# EasyEDA schematic 1-Schematic_power_supply.json
TITLE: Sheet_1; REV: 1.0; Date: 2023-05-28; Sheet: 1/1; Drawn By: rf3mechanic; Company: Your Company
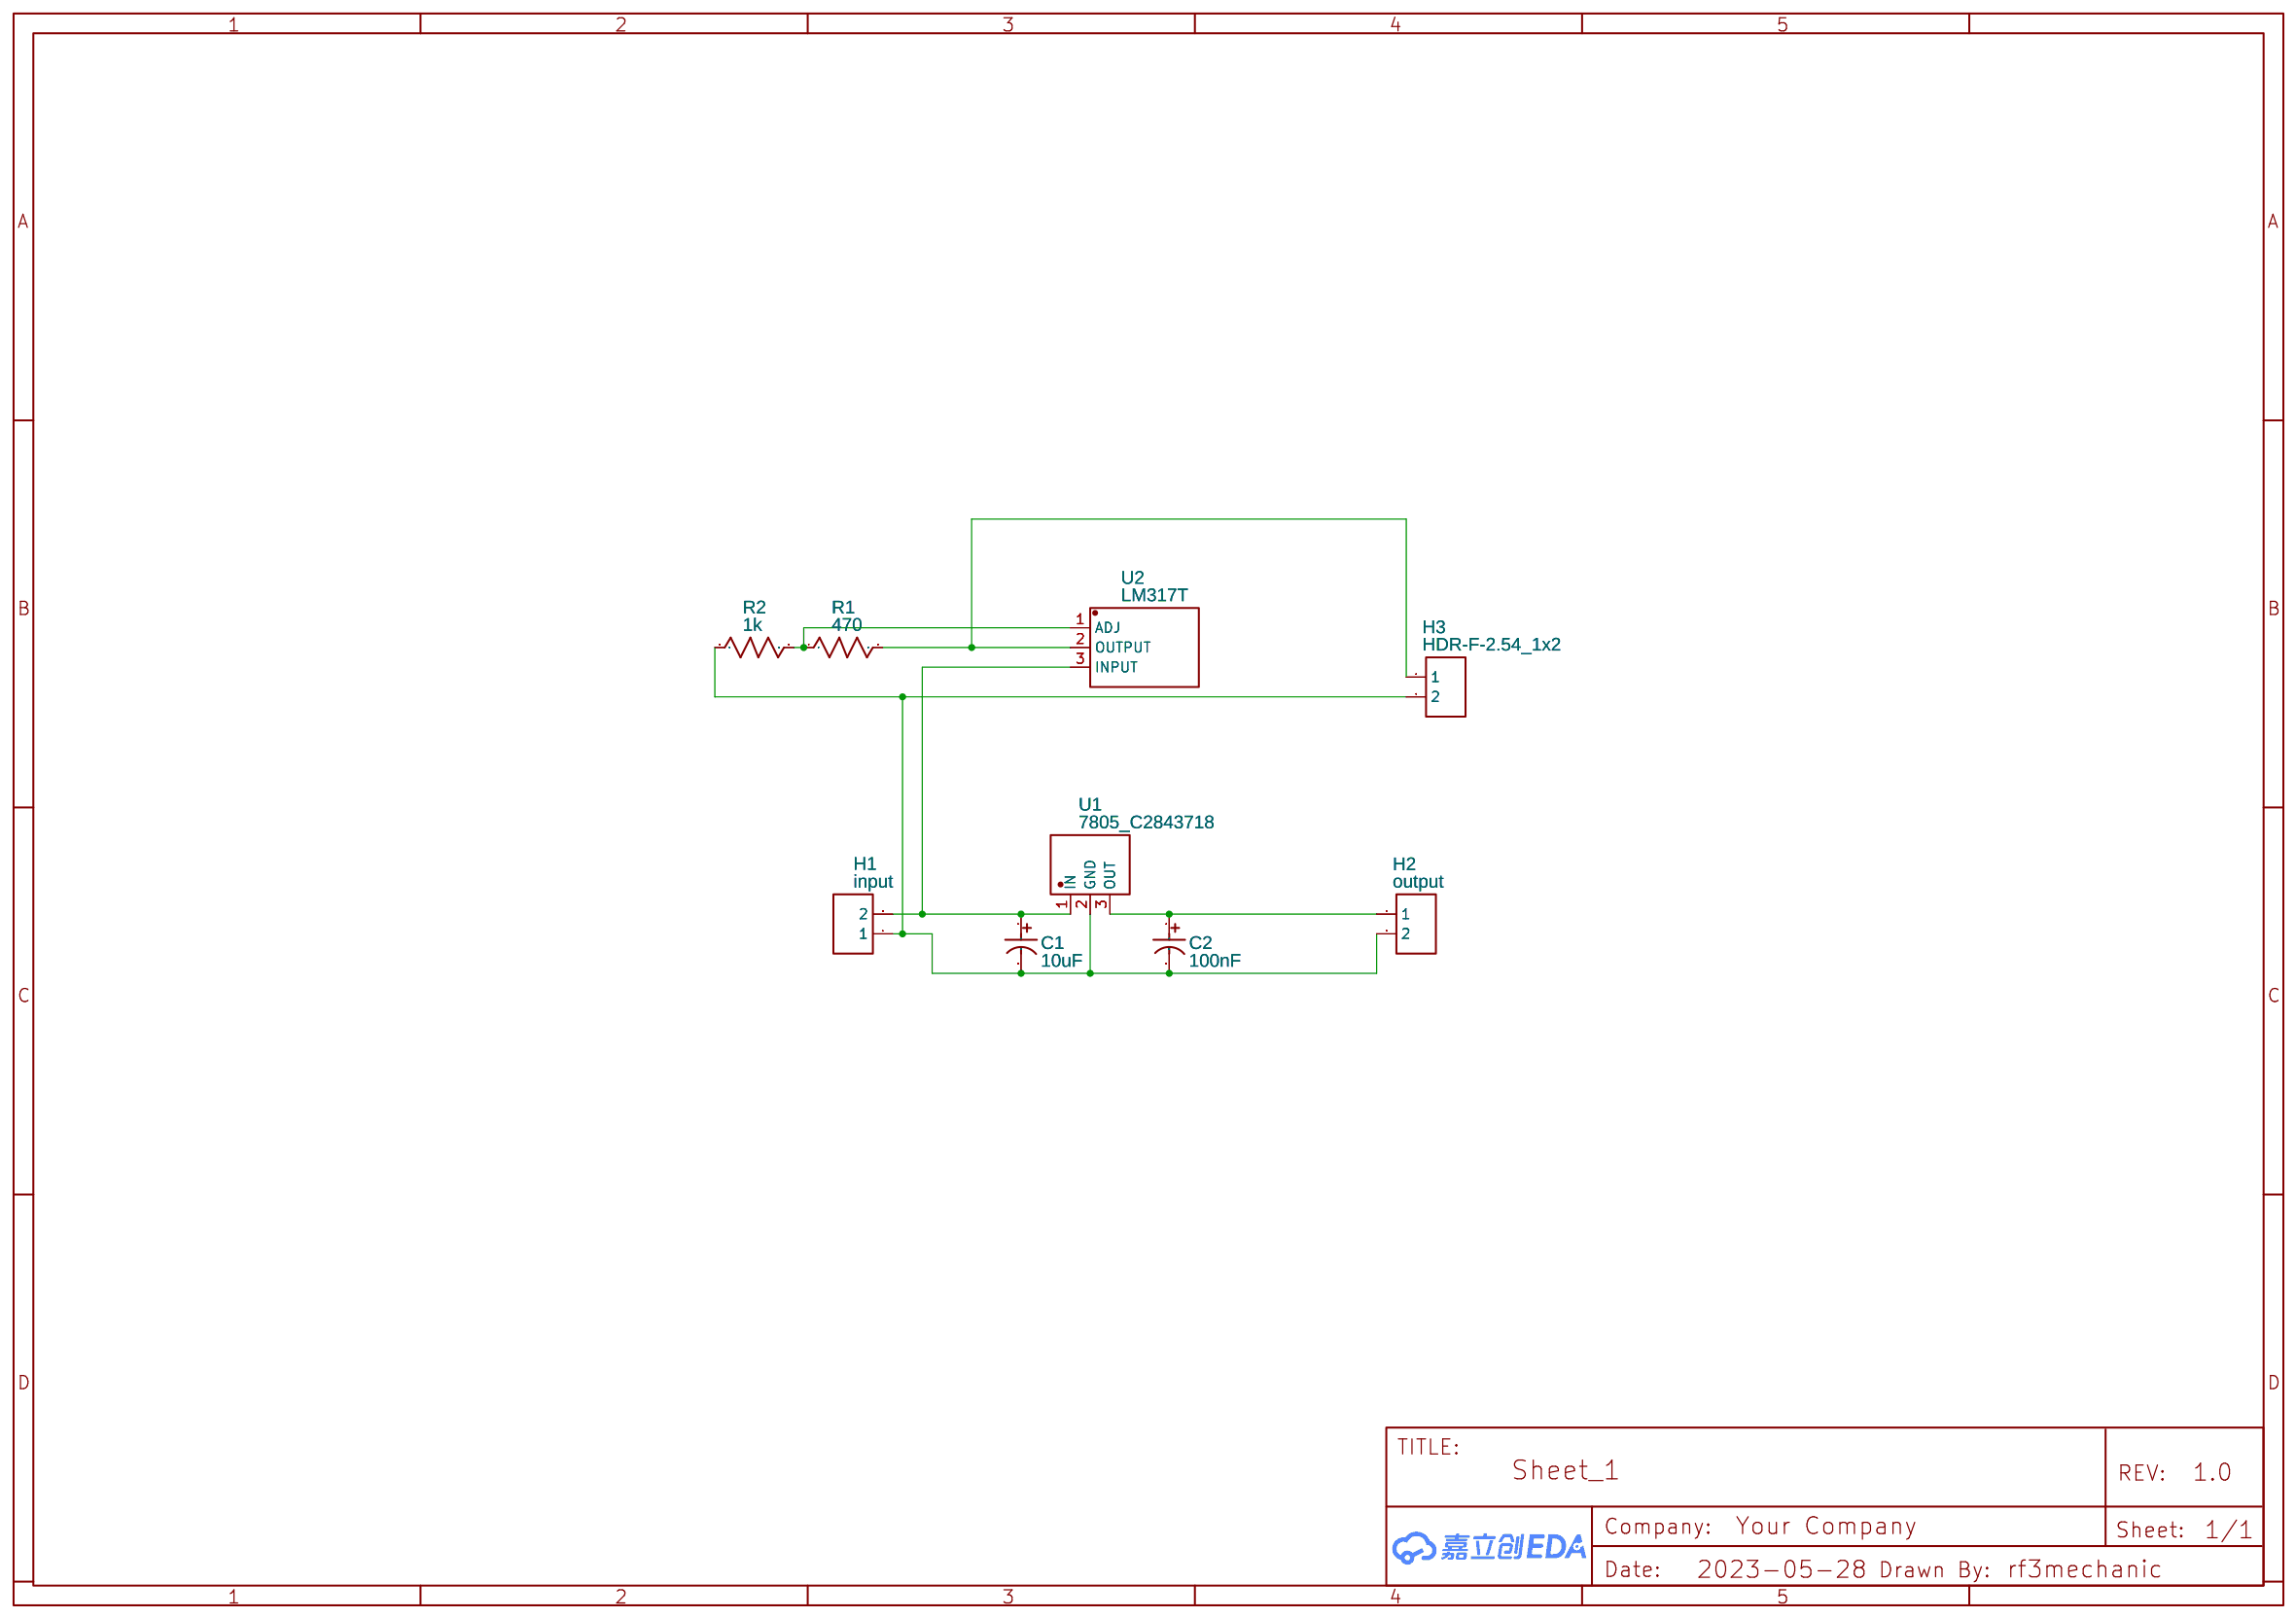
[diagram p0: schematic sheet]

## Parts
C1  10uF  [CAP-TH_BD5.0-P2.00-D0.8-FD]
C2  100nF  [CAP-TH_BD5.0-P2.00-D0.8-FD]
H1  input  [HDR-F-2.54_1X2]
H2  output  [HDR-F-2.54_1X2]
H3  HDR-F-2.54_1x2  [HDR-F-2.54_1X2]
R1  470  [R_AXIAL-0.4]
R2  1k  [R_AXIAL-0.4]
U1  7805_C2843718  [TO-220-3_L10.0-W4.5-P2.54-L]
U2  LM317T  [TO-220AB-3_L10.4-W4.6-P2.54-T]

## Library data of the parts
C1 = 10uF 16V 5*11: Supplier: LCSC; Manufacturer: CX(承兴); Manufacturer Part: KM106M016D11RR0VH2FP0; Supplier Part: C43799; JLCPCB Part Class: Extended Part
C2 = 0.1UF 50V: Supplier: LCSC; Manufacturer: CX(承兴); Manufacturer Part: KM104M050D11RR0VH2FP0; Supplier Part: C28061; JLCPCB Part Class: Extended Part
H1-H3 = HDR-F-2.54_1x2: Supplier Part: C49661; Supplier: LCSC; Contributor: LCEDA_Lib
R1 R2 = R_AXIAL-0.4_US: Contributor: LCEDA_Lib
U1 = 7805_C2843718: Supplier: LCSC; Supplier Part: C2843718; Manufacturer: PUOLOP(迪浦); Manufacturer Part: 7805; Contributor: LCSC; JLCPCB Part Class: Extended Part
U2 = LM317T: Supplier: LCSC; Supplier Part: C361026; Manufacturer: ST(意法半导体); Contributor: LCSC; JLCPCB Part Class: Extended Part

## Nets
Net-(C1-1): C1.1 H1.2 U1.1(IN) U2.3(INPUT)
Net-(C1-2): C1.2 C2.2 H1.1 H2.2 H3.2 R2.1 U1.2(GND)
Net-(C2-1): C2.1 H2.1 U1.3(OUT)
Net-(H3-1): H3.1 R1.2 U2.2(OUTPUT)
Net-(R1-1): R1.1 R2.2 U2.1(ADJ)
